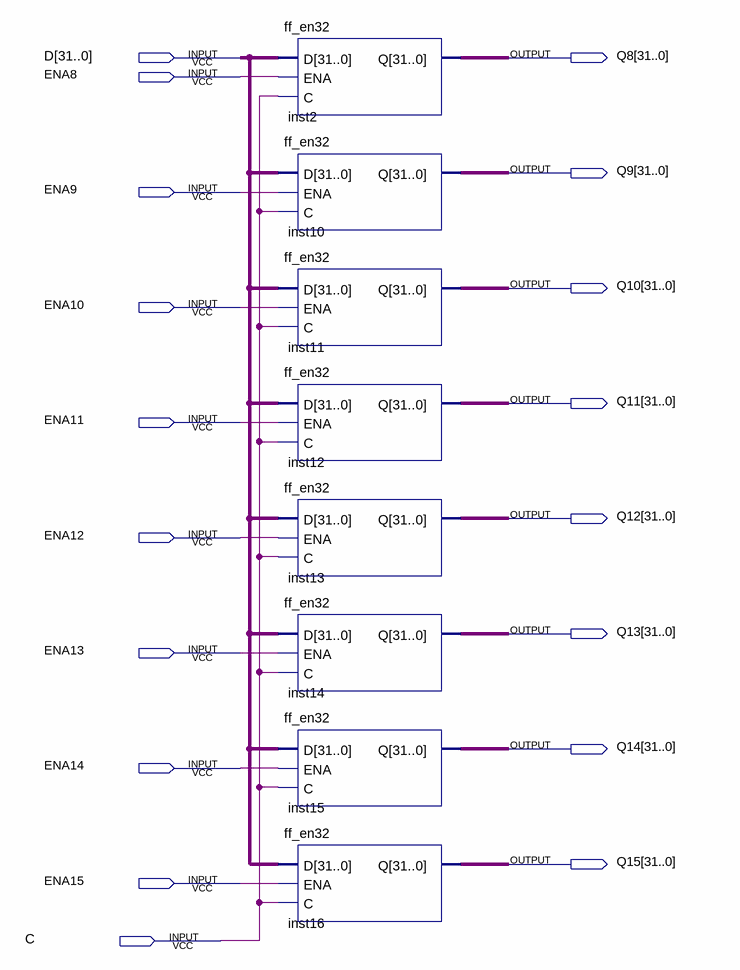
[diagram p0: schematic sheet]
// Quartus schematic ff8_en32_1.bdf as structural Verilog: 8 symbols, 18 pins
module ff8_en32_1 (
  input  [31:0] D,
  input  ENA8,
  input  ENA9,
  input  ENA10,
  input  ENA11,
  input  ENA12,
  input  ENA13,
  input  ENA14,
  input  ENA15,
  input  C,
  output [31:0] Q8,
  output [31:0] Q9,
  output [31:0] Q10,
  output [31:0] Q11,
  output [31:0] Q12,
  output [31:0] Q13,
  output [31:0] Q14,
  output [31:0] Q15
);

  ff_en32 inst2 (.D(D), .ENA(ENA8), .C(C), .Q(Q8));
  ff_en32 inst10 (.D(D), .ENA(ENA9), .C(C), .Q(Q9));
  ff_en32 inst11 (.D(D), .ENA(ENA10), .C(C), .Q(Q10));
  ff_en32 inst12 (.D(D), .ENA(ENA11), .C(C), .Q(Q11));
  ff_en32 inst13 (.D(D), .ENA(ENA12), .C(C), .Q(Q12));
  ff_en32 inst14 (.D(D), .ENA(ENA13), .C(C), .Q(Q13));
  ff_en32 inst15 (.D(D), .ENA(ENA14), .C(C), .Q(Q14));
  ff_en32 inst16 (.D(D), .ENA(ENA15), .C(C), .Q(Q15));
endmodule
